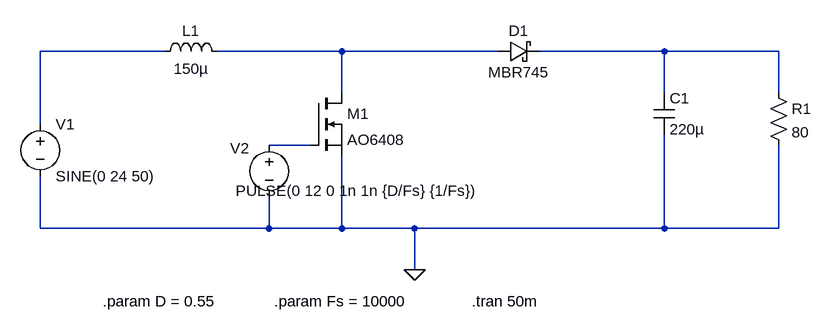
[diagram p0: schematic boostconv.asc]
boostconv.asc, the LTspice schematic file:
Version 4.1
SHEET 1 1908 888
WIRE 32 160 -160 160
WIRE 304 160 112 160
WIRE 544 160 304 160
WIRE 800 160 608 160
WIRE 976 160 800 160
WIRE 304 224 304 160
WIRE 800 224 800 160
WIRE 976 224 976 160
WIRE -160 272 -160 160
WIRE 256 304 192 304
WIRE -160 432 -160 352
WIRE 192 432 192 384
WIRE 192 432 -160 432
WIRE 304 432 304 320
WIRE 304 432 192 432
WIRE 416 432 304 432
WIRE 800 432 800 288
WIRE 800 432 416 432
WIRE 976 432 976 304
WIRE 976 432 800 432
WIRE 416 496 416 432
FLAG 416 496 0
SYMBOL voltage -160 256 R0
WINDOW 123 0 0 Left 0
WINDOW 39 0 0 Left 0
SYMATTR InstName V1
SYMATTR Value SINE(0 24 50)
SYMBOL ind 16 176 R270
WINDOW 0 32 56 VTop 2
WINDOW 3 5 56 VBottom 2
SYMATTR InstName L1
SYMATTR Value 150µ
SYMATTR SpiceLine Rser=1m
SYMBOL nmos 256 224 R0
SYMATTR InstName M1
SYMATTR Value AO6408
SYMBOL schottky 544 176 R270
WINDOW 0 32 32 VTop 2
WINDOW 3 0 32 VBottom 2
SYMATTR InstName D1
SYMATTR Value MBR745
SYMATTR Description Diode
SYMATTR Type diode
SYMBOL cap 784 224 R0
SYMATTR InstName C1
SYMATTR Value 220µ
SYMBOL res 960 208 R0
SYMATTR InstName R1
SYMATTR Value 80
SYMBOL voltage 192 288 R0
WINDOW 0 -60 21 Left 2
WINDOW 3 -51 86 Left 2
WINDOW 123 0 0 Left 0
WINDOW 39 0 0 Left 0
SYMATTR InstName V2
SYMATTR Value PULSE(0 12 0 1n 1n {D/Fs} {1/Fs})
TEXT -64 544 Left 2 !.param D = 0.55
TEXT 200 544 Left 2 !.param Fs = 10000
TEXT 504 544 Left 2 !.tran 50m

The netlist it stands for:
* boostconv.asc
V1 N001 0 SINE(0 24 50)
L1 N001 N002 150µ Rser=1m
M1 N002 N004 0 0 AO6408
D1 N002 N003 MBR745
C1 N003 0 220µ
R1 N003 0 80
V2 N004 0 PULSE(0 12 0 1n 1n {D/Fs} {1/Fs})
.model D D
.lib standard.dio
.model NMOS NMOS
.model PMOS PMOS
.lib standard.mos
.param D = 0.55
.param Fs = 10000
.tran 50m
.backanno
.end